# EAGLE design psu (EAGLE 8.7.1)
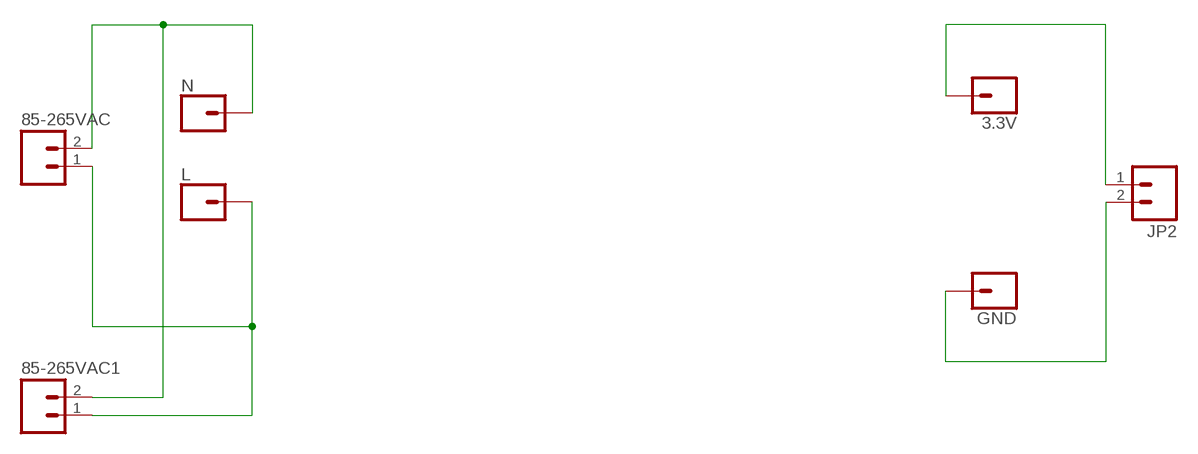
[diagram p0: schematic, sheet 1]

## Parts
3.3V  CONN_01PTH_1.4MM  [1X01_1.4MM]
85-265VAC  M02PTH3_5MM  [1X02_LONGPADS]
85-265VAC1  M02PTH3_5MM  [1X02_LONGPADS]
GND  CONN_01PTH_1.4MM  [1X01_1.4MM]
JP2  M02PTH3_5MM  [1X02_LONGPADS]
L  CONN_01PTH_1.4MM  [1X01_1.4MM]
N  CONN_01PTH_1.4MM  [1X01_1.4MM]

## Nets
N$1: 85-265VAC1.1 85-265VAC.1 L.1
N$2: 85-265VAC1.2 85-265VAC.2 N.1
N$3: 3.3V.1 JP2.1
N$4: GND.1 JP2.2

## Library data of the parts
3.3V GND L N = 1X01:CONN_01: Single connection point. Often used as Generic Header-pin footprint for 0.1 inch spaced/style header connections On any of the 0.1 inch spaced packages, you can populate with these: Break Away Headers - Straight <https://www.sparkfun.com/products/116> (PRT-00116) Break Away Male Headers - Right Angle <https://www.sparkfun.com/products/553> (PRT-00553) Female Headers <https://www.sparkfun.com/products/115> (PRT-00115) Break Away Headers - Machine Pin <https://www.sparkfun.com/products/117> (PRT-00117) Break Away Female Headers - Swiss Machine Pin <https://www.sparkfun.com/products/743> (PRT-00743) This device is also useful as a general connection point to wire up your design to another part of your project. Our various solder wires solder well into these plated through hole pads. Hook-Up Wire - Assortment (Stranded, 22 AWG) <https://www.sparkfun.com/products/11375> (PRT-11375) Hook-Up Wire - Assortment (Solid Core, 22 AWG) <https://www.sparkfun.com/products/11367> (PRT-11367) View the entire wire category on our website here <https://www.sparkfun.com/categories/141> Special notes: SMTSO-256-ET is a "flush mount" nut for a 4-40 screw. We mostly use this on specialty testbeds; it is a nice way to connect hardware to your PCB at an adjustable hieght. Also note, the SNAP packages are for using a snappable style connector. We sell a baggie of snaps and they are also used on two LilyPad designs: Snap Assortment - 30 pack (male and female) <https://www.sparkfun.com/products/11347> (DEV-11347) LilyPad Arduino SimpleSnap <https://www.sparkfun.com/products/10941> (DEV-10941) LilyPad SimpleSnap Protoboard <https://www.sparkfun.com/products/10940> (DEV-10940)
85-265VAC 85-265VAC1 JP2 = SparkFun (old):M02: Header 2 Standard 2-pin 5 mm header

## Board
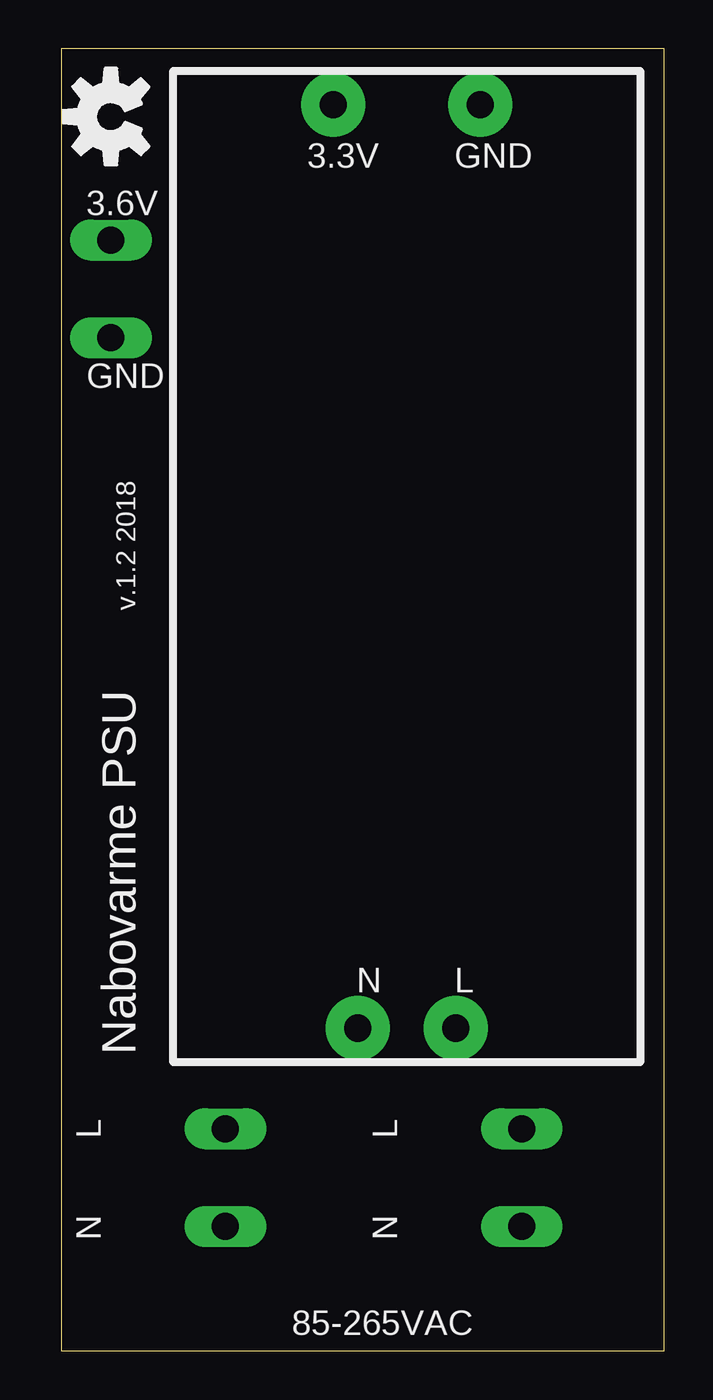
[diagram p1: board, top side]
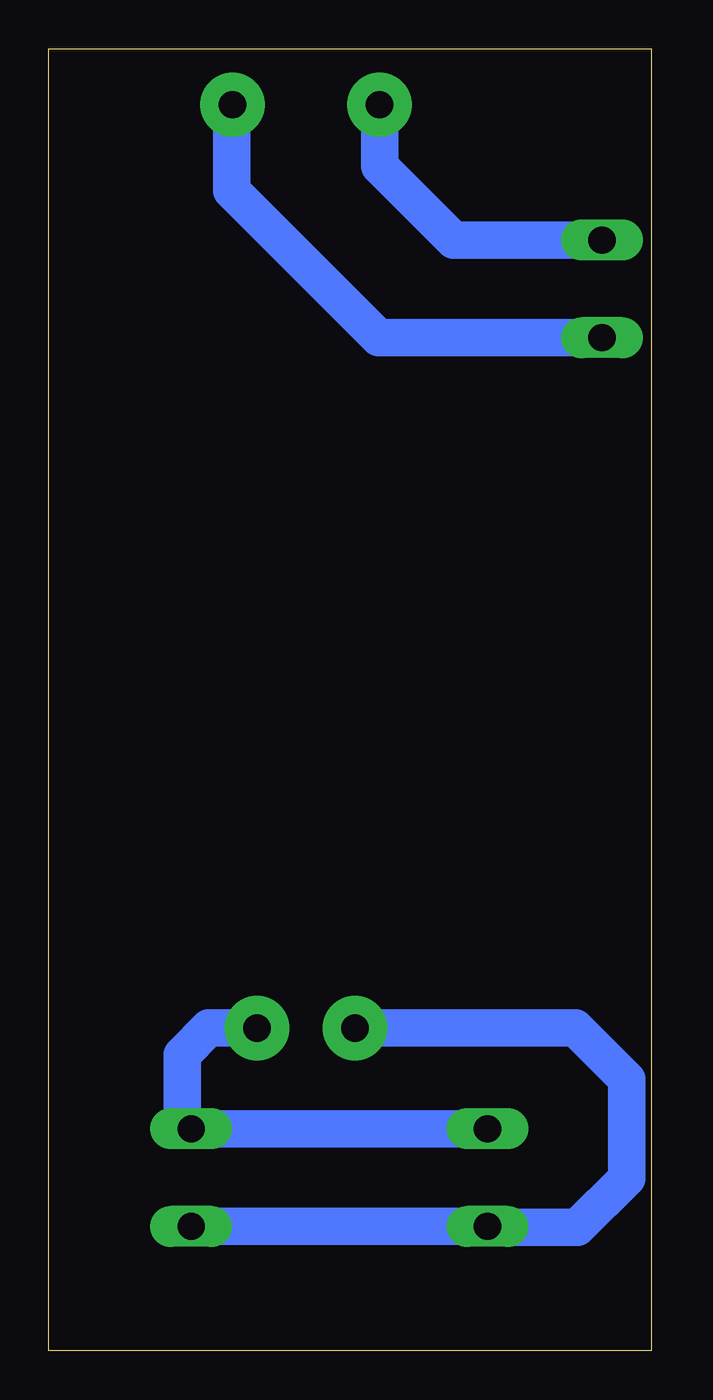
[diagram p2: board, bottom side, seen from below]

Size 31 x 67 mm. Coordinates in mm from the lower left corner, seen from the top.
Outline: 0,0 31,0 31,67 0,67 0,0
Copper layers (1*16): Top 0.035mm / dielectric 1.5mm / Bottom 0.035mm
Design rules "default": minimum track width 10mil, minimum drill 24mil, track to track 8mil, track to pad 8mil, pad to pad 8mil, via to via 8mil, smd to smd 8mil, copper to edge 40mil, drill to drill 8mil, minimum pad ring 10mil, minimum via ring 8mil, stop-mask expansion 4mil, vias tented up to drill 0mil, thermal gap 10mil

### Footprints (pad centres in the part's own frame; a part is rotated, then mirrored left to right if it is on the bottom)
1X01_1.4MM = drill 1.4 pad 3.302: 1 0,0
1X02_LONGPADS = drill 1.4 pad 1.93 long: 1 0,0; 2 5.02,0

### Placement (x,y rotation side)
3.3V  13.98,64.11 0 top
85-265VAC  23.67,11.43 270 top
85-265VAC1  8.43,11.43 270 top
GND  21.54,64.11 0 top
JP2  2.54,57.15 270 top
L  20.28,16.61 0 top
N  15.24,16.61 0 top
U$1  [OSHW-LOGO-M]  2.54,63.5 90 top

### Tracks (layer width: path | path; a pad name or v marks a point on that pad's centre or on a via)
N$1
  Bottom 1.93: 85-265VAC1.1 85-265VAC.1 24.13,11.89 24.13,15.24 22.76,16.61 L.1
N$2
  Bottom 1.93: N.1 3.91,16.61 1.27,13.97 1.27,8.89 3.81,6.35 8.37,6.35 85-265VAC1.2 85-265VAC.2
N$3
  Bottom 1.93: JP2.1 10.16,57.15 13.97,60.96 3.3V.1
N$4
  Bottom 1.93: JP2.2 14.03,52.13 21.59,59.69 21.59,64.06 GND.1

### Text on the board
tNames: 3.6V | GND | v.1.2 2018 | Nabovarme PSU | L | L | N | N